# Altium schematic sheet SystemPower.SchDoc
size A
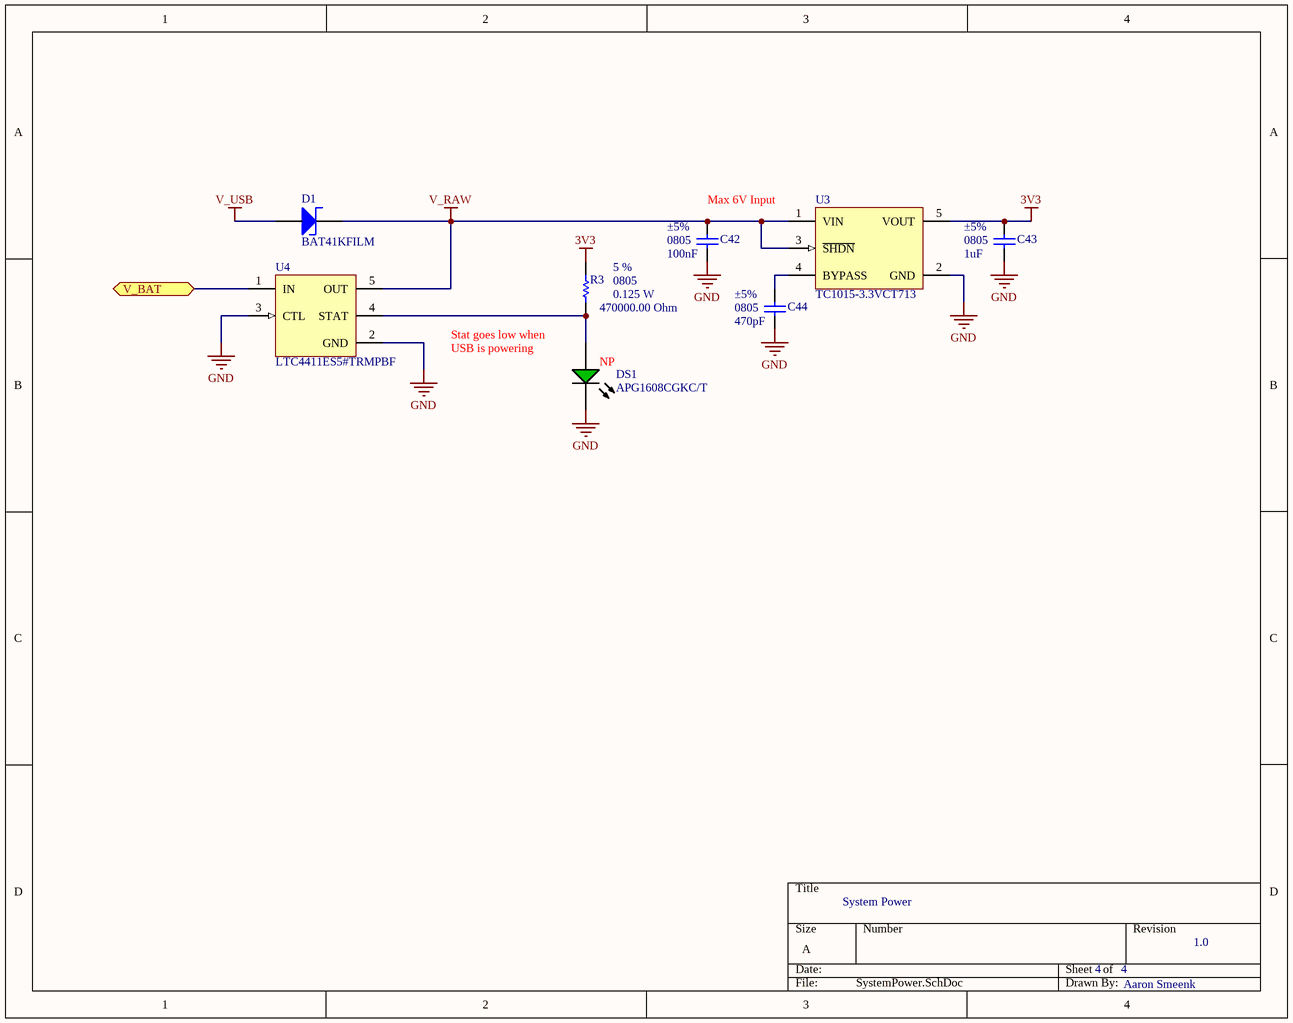
[diagram p0: SystemPower.SchDoc]

## Parts
C42  value 100nF  Tolerance: ±5%  Case-EIA: 0805  [CAPC0805(2012)100_L]  (hidden comment: CAP 100nF 6.3V 0805(2012))
C43  value 1uF  Tolerance: ±5%  Case-EIA: 0805  [CAPC0805(2012)100_M]  (hidden comment: CAP 1uF 6.3V 0805(2012))
C44  value 470pF  Case-EIA: 0805  Tolerance: ±5%  [CAPC0805(2012)100_L]  (hidden comment: CAP 470pF 6.3V 0805(2012))
D1  BAT41KFILM  [BAT41KFILM]
DS1  APG1608CGKC/T  [KING-LED0603-25-GREEN_V]
R3  value 470000.00 Ohm  Power: 0.125 W  Tolerance: 5 %  Case-EIA: 0805  [RESC0805(2012)_M]  (hidden comment: 470K 5% 0805(2012))
U3  TC1015-3.3VCT713  [SOT-23-CT5_M]
U4  LTC4411ES5#TRMPBF  [LT-S5-5-TSOT-23_N]

## Ports
V_BAT

## Nets
3V3: C43.2 R3.2 U3.5(VOUT)
GND: C42.1 C43.1 C44.1 DS1.2(K) U3.2(GND) U4.2(GND) U4.3(CTL)
V_RAW: C42.2 D1.1 U3.1(VIN) U3.3(~{SHDN}) U4.5(OUT)
V_USB: D1.2
V_BAT: U4.1(IN) ; port V_BAT
NetC44_2: C44.2 U3.4(BYPASS)
NetDS1_1: DS1.1(A) R3.1 U4.4(STAT)

## Notes on the sheet
- Max 6V Input
- Stat goes low when
- USB is powering
- (near DS1) NP
- System Power
- 4
- 1.0
- Aaron Smeenk

## Library data of the parts
C42 = CMP-1036-04390-1: CAP 100nF 6.3V ±5% 0805 (2012 Metric) Thickness 1mm SMD; Case-Metric: 2012; Rated Voltage: 6.3 V; Technology: SMT; Max Thickness: 1 mm
C43 = CMP-1036-04730-1: CAP 1uF 6.3V ±5% 0805 (2012 Metric) Thickness 1mm SMD; Case-Metric: 2012; Technology: SMT; Max Thickness: 1 mm; Rated Voltage: 6.3 V
C44 = CMP-1036-02639-1: CAP 470pF 6.3V ±5% 0805 (2012 Metric) Thickness 1mm SMD; Case-Metric: 2012; Rated Voltage: 6.3 V; Technology: SMT; Max Thickness: 1 mm
D1 = BAT41KFILM: DIODE SCHOTTKY 100V 200MA SOD523; Current - Average Rectified (Io): 200mA (DC); Voltage - Forward (Vf) (Max) @ If: 1V @ 200mA; Speed: Small Signal =< 200mA (Io), Any Speed; Current - Reverse Leakage @ Vr: 100nA @ 50V; Capacitance @ Vr, F: 10pF @ 1V, 1MHz; Diode Type: Schottky; Voltage - DC Reverse (Vr) (Max): 100V; Package / Case: SOD-523
DS1 = CMP-0239-00001-1: LED, SMT, 0603(1608), 0.25mm Thickness, Green; Forward Current: 30 mA; Reverse Voltage: 5 V; Power Dissipation: 78 mW; Packing: Reel; ComponentLink1Description: Manufacturer URL; ComponentLink1URL: http://www.kingbrightusa.com/; ComponentLink2URL: http://www.kingbrightusa.com/images/catalog/SPEC/APG1608CGKC-T.pdf; Mounting Technology: Surface Mount; Storage Temperature: -40 to 85 degC; DatasheetVersion: Rev. 5B, 10/2012; PartNumber: APG1608CGKC/T; PackageReference: LED0603-25-GREEN; ComponentLink2Description: Datasheet; PackageDescription: 2-Pin SMT LED, 1.6 x 0.8 mm Body, 0.25mm Thickness; PackageVersion: Rev. 5B, 10/2012
R3 = CMP-1013-00138-1: 470K 0.125W 5% 0805 (2012 Metric)  SMD; Case-Metric: 2012; Technology: SMT
U3 = CMP-0136-00586-1: 50 mA, 100 mA and 150 mA CMOS LDOs with Active-Low Shutdown and Reference Bypass, 5-Pin SOT-23, Extended Temperature, Tape and Reel; PackageDescription: 5-Lead Plastic Small Outline Transistor (CT) [SOT-23]; PackageReference: SOT-23-CT5; PackageVersion: revBB, Aug-2009; DatasheetVersion: revE, Feb-2007; Code_IPC: SOT23-5
U4 = CMP-0479-00414-1: Integrated Switch: Replaces Power Supply OR, 2.6 to 5.5 V Vin, 5-pin SOT23 (S5-5), -40 to 85 degC, Pb-Free, Mini Tape and Reel; Manufacturer: Linear Technology; Ideal Diode: Single, Internal, P-Channel; ComponentLink2Description: Datasheet; ComponentLink1URL: http://www.linear.com/; RoHS: TRUE; PackageDescription: 5-Pin Plastic TSOT-23, Body 1.63 x 2.90 mm, Pitch 0.95 mm; PackageReference: S5-5; Mounting Technology: Surface Mount; PackageVersion: Jun-10; ComponentLink3URL: http://cds.linear.com/docs/en/packaging/SOT_5_05-08-1635.pdf; PartNumber: LTC4411ES5#TRMPBF; ComponentLink3Description: Package Specification; Code_JEDEC: MO-193; ComponentLink2URL: http://cds.linear.com/docs/en/datasheet/4411fa.pdf; Packing: Mini Tape and Reel; ComponentLink1Description: Manufacturer URL; DatasheetVersion: Rev. A